# Altium schematic sheet DIB_Top_Sheet.SchDoc
size A4
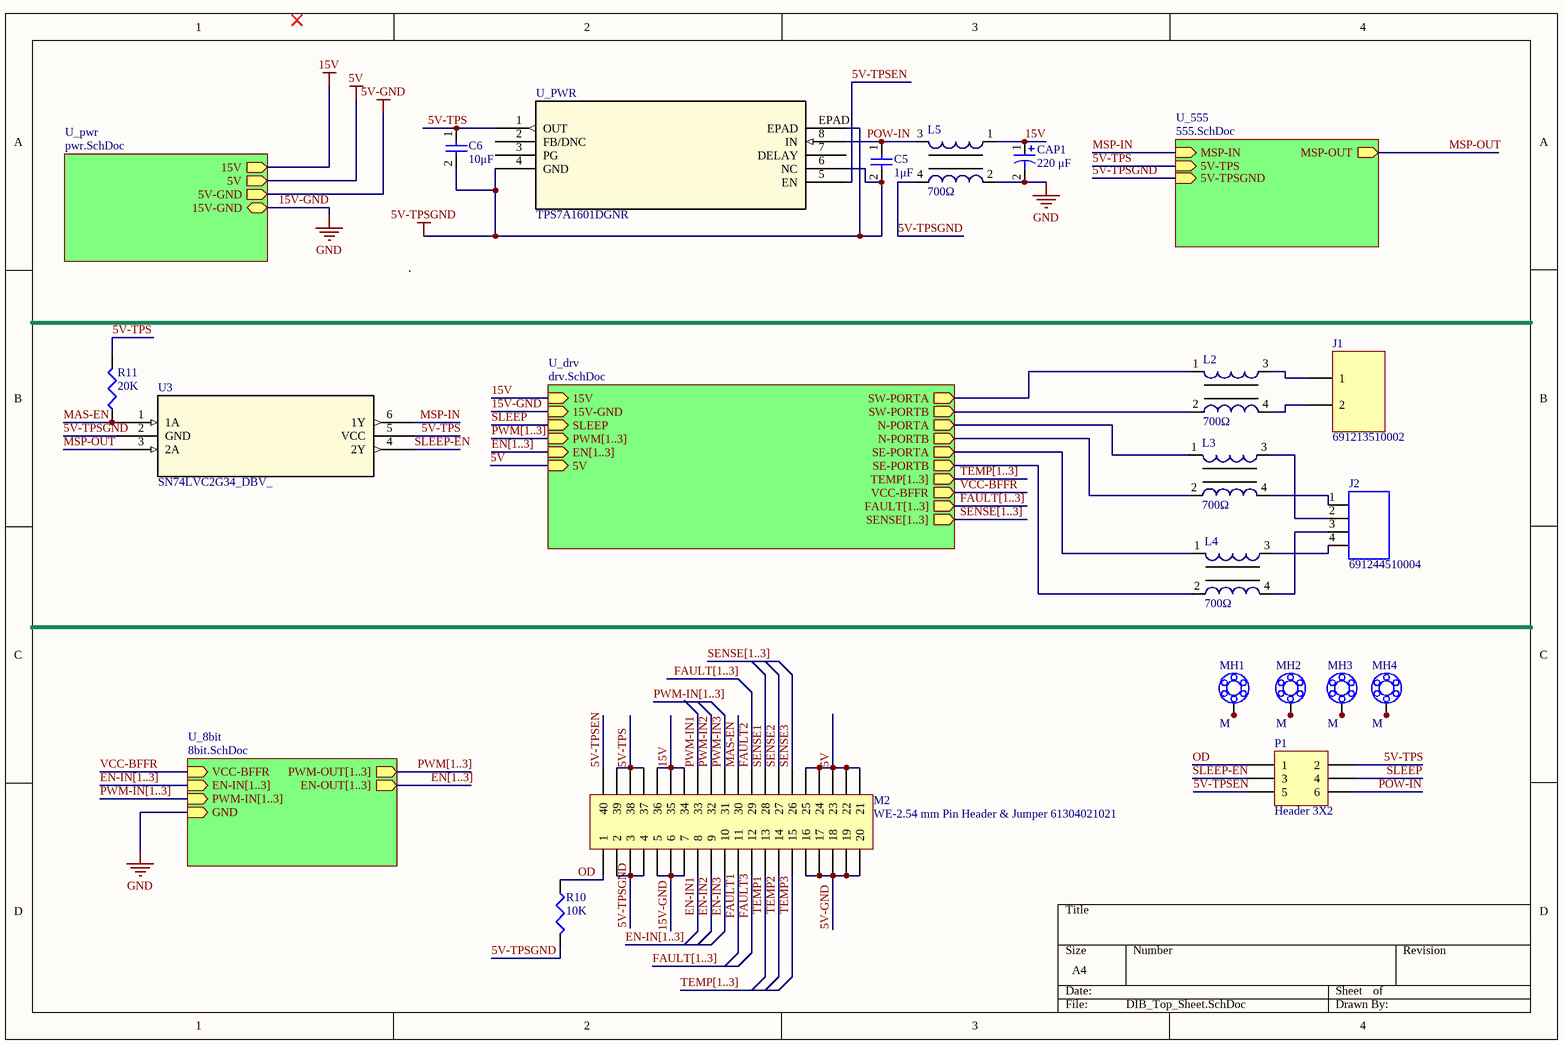
[diagram p0: DIB_Top_Sheet.SchDoc]

## Parts
C5  1μF  [WCAP-CSGP 0805, H=1.25mm]
C6  10μF  [WCAP-CSGP 0805, H=1.25mm]
CAP1  220 μF  [WCAP-ASLL 10x10.5x4.5]
J1  691213510002  [691213510002]
J2  691244510004  [691244510004]
L2  700Ω  [IND_TDK_ACM70600]
L3  700Ω  [IND_TDK_ACM70600]
L4  700Ω  [IND_TDK_ACM70600]
L5  700Ω  [IND_TDK_ACM70600]
M2  WE-2.54 mm Pin Header & Jumper 61304021021  [61304021021]
MH1  M  [MOUNTING]  (no BOM)
MH2  M  [MOUNTING]  (no BOM)
MH3  M  [MOUNTING]  (no BOM)
MH4  M  [MOUNTING]  (no BOM)
P1  Header 3X2  [HDR2X3]
R10  10K  [J1-0603]
R11  20K  [J1-0603]
U3  SN74LVC2G34_DBV_  [DBV6]
U_PWR  TPS7A1601DGNR  [DGN8_1P92X1P6]

## Sub-sheets
U_8bit = 8bit.SchDoc: EN-IN[1..3] (in), PWM-OUT[1..3] (out), EN-OUT[1..3] (out), PWM-IN[1..3] (in), GND (in), VCC-BFFR (in)
U_555 = 555.SchDoc: MSP-IN (in), MSP-OUT (out), 5V-TPS (in), 5V-TPSGND (in)
U_drv = drv.SchDoc: 15V (in), SW-PORTA (out), SW-PORTB (out), 15V-GND (in), N-PORTA (out), N-PORTB (out), SE-PORTB (out), SE-PORTA (out), TEMP[1..3] (out), VCC-BFFR (out), SLEEP (in), PWM[1..3] (in), EN[1..3] (in), FAULT[1..3] (out), SENSE[1..3] (out), 5V (in)
U_pwr = pwr.SchDoc: 15V (out), 5V (out), 5V-GND (out), 15V-GND

## Nets
5V: M2.21 M2.22 M2.23 M2.24 M2.25 ; sheet U_pwr/5V, sheet U_drv/5V
5V-GND: M2.16 M2.17 M2.18 M2.19 M2.20 ; sheet U_pwr/5V-GND
5V-TPSGND: C5.2 C6.2 L5.4 M2.2 M2.3 M2.4 R10.1 U3.2(GND) U_PWR.4(GND) U_PWR.6(NC) U_PWR.EPAD ; sheet U_555/5V-TPSGND
15V: CAP1.1 L5.1 M2.34 M2.35 M2.36 ; sheet U_pwr/15V, sheet U_drv/15V
15V-GND: CAP1.2 L5.2 M2.5 M2.6 M2.7 ; sheet U_pwr/15V-GND, sheet U_drv/15V-GND, sheet U_8bit/GND  [also labelled GND]
5V-TPS: C6.1 M2.37 M2.38 M2.39 P1.2 R11.2 U3.5(VCC) U_PWR.1(OUT) ; sheet U_555/5V-TPS
5V-TPSEN: M2.40 P1.5 U_PWR.5(EN)
EN-IN1: M2.8
EN-IN2: M2.9
EN-IN3: M2.10
FAULT1: M2.11
FAULT2: M2.29
FAULT3: M2.12
MAS-EN: M2.30 R11.1 U3.1(1A)
MSP-IN: U3.6(1Y) ; sheet U_555/MSP-IN
MSP-OUT: U3.3(2A) ; sheet U_555/MSP-OUT
OD: M2.1 P1.1 R10.2
POW-IN: C5.1 L5.3 P1.6 U_PWR.8(IN)
PWM-IN1: M2.33
PWM-IN2: M2.32
PWM-IN3: M2.31
SENSE1: M2.28
SENSE2: M2.27
SENSE3: M2.26
SLEEP: P1.4 ; sheet U_drv/SLEEP
SLEEP-EN: P1.3 U3.4(2Y)
TEMP1: M2.13
TEMP2: M2.14
TEMP3: M2.15
VCC-BFFR: sheet U_drv/VCC-BFFR, sheet U_8bit/VCC-BFFR
NetJ1_1: J1.1 L2.3
NetJ1_2: J1.2 L2.4
NetJ2_1: J2.1 L3.4
NetJ2_2: J2.2 L3.3
NetJ2_3: J2.3 L4.4
NetJ2_4: J2.4 L4.3
NetL2_1: L2.1 ; sheet U_drv/SW-PORTA
NetL2_2: L2.2 ; sheet U_drv/SW-PORTB
NetL3_1: L3.1 ; sheet U_drv/N-PORTA
NetL3_2: L3.2 ; sheet U_drv/N-PORTB
NetL4_1: L4.1 ; sheet U_drv/SE-PORTA
NetL4_2: L4.2 ; sheet U_drv/SE-PORTB
NetMH1_1: MH1.1 MH1.2 MH1.3 MH1.4 MH1.5 MH1.6 MH1.7 MH1.8 MH1.9
NetMH2_1: MH2.1 MH2.2 MH2.3 MH2.4 MH2.5 MH2.6 MH2.7 MH2.8 MH2.9
NetMH3_1: MH3.1 MH3.2 MH3.3 MH3.4 MH3.5 MH3.6 MH3.7 MH3.8 MH3.9
NetMH4_1: MH4.1 MH4.2 MH4.3 MH4.4 MH4.5 MH4.6 MH4.7 MH4.8 MH4.9

Not connected (* = marked no-connect by the designer): U_PWR 2(FB/DNC) 3(PG) 7(DELAY)

## Buses and harness runs
bus EN-IN[1..3]
bus EN-IN[1..3] = sheet U_8bit/EN-IN[1..3]
bus EN[1..3] = sheet U_8bit/EN-OUT[1..3]
bus EN[1..3] = sheet U_drv/EN[1..3]
bus FAULT[1..3]
bus FAULT[1..3] = sheet U_drv/FAULT[1..3]
bus PWM-IN[1..3]
bus PWM-IN[1..3] = sheet U_8bit/PWM-IN[1..3]
bus PWM[1..3] = sheet U_8bit/PWM-OUT[1..3]
bus PWM[1..3] = sheet U_drv/PWM[1..3]
bus SENSE[1..3]
bus SENSE[1..3] = sheet U_drv/SENSE[1..3]
bus TEMP[1..3]
bus TEMP[1..3] = sheet U_drv/TEMP[1..3]

## Library data of the parts
C5 = WCAP-CSGP 0805, 885012207026: CAP CER 1UF 50V 10% X5R 0805; Manufacturer: TDK; partNo: CGA4J3X5R1H105K125AB (C6); ComponentLink1Description: TDK; ComponentLink1URL: http://www.TDK.com; Created by: Saurabh; Created Date: 3/9/2015; Capacitance: 1μF
C6 = WCAP-CSGP 0805, 885012207026: CAP CER 10UF 6.3V 10% X7R 0805; Manufacturer: TDK; partNo: CGJ4J1X7R0J106K125AC; ComponentLink1Description: TDK; ComponentLink1URL: http://www.TDK.com; Created by: Saurabh; Created Date: 3/9/2015; Capacitance: 10μF
CAP1 = WCAP-ASLL 10x10.5x4.5 865060557008: WCAP-ASLL Aluminum Electrolytic Capacitors , 220 μF; + / - 20%; 35 V , 10 x 10,5; Manufacturer: Wurth Elektronik; E-mail: libraries@we-online.com; Characteristics: Aluminum Electrolytic Capacitor;Recommended soldering: Reflow;Operating temperature: –55 °C to +105 °C;Low impedance product series;Load life: 2000–5000 h @ +105 °C; ComponentLink1Description: Manufacturer; ComponentLink1URL: http://www.we-online.com; ComponentLink2Description: Datasheet; ComponentLink2URL: http://katalog.we-online.de/pbs/datasheet/865060557008.pdf; Created by: Karrer Zheng; Created Date: 5/13/2015; Capacitance: 220 μF; Application: Energy storage or high frequency filtering in the low voltage circuit; used as power supply filtering in general switching power supply, DC-DC converter, AC-DC converter, conversion adapter, charger, TV, VCR, DC motor circuit filter, digital audio, digital TV, digital camera, digital video camera, satellite receiver, equipment control panel and etc.; partNo: 865060557008
J1 = 691213510002: Horizontal Cable Entry with Rising Cage Clamp, Serie 2135 - 5.08 mm; Manufacturer: Wurth Elektronik; ComponentLink1 Description: Manufacturer; ComponentLink2 Description: Datasheet; NoPins: 2; ComponentLink1 URL: http://www.we-online.com; ComponentLink2 URL: http://katalog.we-online.de/em/datasheet/6912135100xx.pdf; Created By: Baojun Chen; Created Date: 6-Aug-15; PartNo: 691213510002
J2 = 691244510004: WR-TBL Horizontal Cable Entry With Rising Cage Clamp,Serie 2445 - 5.08 mm; Manufacturer: Wurth Elektronik; ComponentLink1 Description: Manufacturer; ComponentLink2 Description: Datasheet; ComponentLink1URL: http://www.we-online.de; ComponentLink2URL: http://katalog.we-online.de/em/datasheet/6912445100XX.pdf; Created by: Baojun Chen; Created Date: 15.Sep.2015; partNo: 691244510004
L2-L4 = WE-SCC 7345, 744281100: ACM7060-701-2PL-TL01; Manufacturer: TDK; partNo: ACM7060-701-2PL-TL01; Inductance: N/A; ComponentLink1Description: TDK; ComponentLink1URL: http://www.tdk.com; Created by: Saurabh Sharma; Created Date: November 2016; Impedance: 700Ω
L5 = WE-SCC 7345, 744281100: ACM7060-701-2PL-TL01; pin to pad: 3>4 4>3; Manufacturer: TDK; partNo: ACM7060-701-2PL-TL01; Inductance: N/A; ComponentLink1Description: TDK; ComponentLink1URL: http://www.tdk.com; Created by: Saurabh Sharma; Created Date: November 2016; Impedance: 700Ω
M2 = WE-2.54 mm Pin Header & Jumper 61304021021: WR-PHD 2.54 mm Angled Dual Pin Header; Manufacturer: W¨¹rth Elektronik eiSos GmbH; ComponentLink1 Description: Manufacturer; ComponentLink2 Description: Datasheet; NoPins: 40; Created Date: 25 March 2013; partNo: 61304021021; ComponentLink1URL: http://www.we-online.com; ComponentLink2URL: http://katalog.we-online.de/em/datasheet/6130xx21021.pdf; Created by: Karrer Zheng
MH1-MH4 = MOUNTING: MOUNTING HOLE - NON INSTALLABLE
P1 = Header 3X2: Header, 3-Pin, Dual row; LatestRevisionDate: 17-Jul-2002; LatestRevisionNote: Re-released for DXP Platform.; Publisher: Altium Limited
R10 R11 = Res3: Resistor; Published: 8-Jun-2000; LatestRevisionDate: 29-May-2009; LatestRevisionNote: IPC-7351 Footprint Added.; PackageReference: J1-0603; Publisher: Altium Limited; PackageDescription: Chip Resistor
  R10: Value: 10K
  R11: Value: 20K
U3 = SN74LVC2G34_DBV_: Imported; Manufacturer: Texas Instruments; Manufacturer_Part_Number: sn74lvc2g34_dbv_6; INDUSTRY_STD_PKG_TYPE: SOT-23; FAMILY_NAME: LL BUFFER GATE; PIN_COUNT: 6; PACKAGE_DESIGNATOR: DBV; Datasheet URL: http://www.ti.com/lit/gpn/SN74LVC2G34; GENERIC_PART_NUMBER: SN74LVC2G34; Vendor: Texas Instruments; RefDes: RefDes; Type: DEV; Value: Value
U_PWR = TPS7A1601DGNR: Imported; Vendor: Texas Instruments; PACKAGE_DESIGNATOR: DGN; PIN_COUNT: 8; FAMILY_NAME: SINGLE CHANNEL LDO; INDUSTRY_STD_PKG_TYPE: MSOP-PowerPAD; 3D_Library_Name: TI_AllParts_2012-12-25; C: Copyright (C) 2015 Accelerated Designs. All rights reserved; Manufacturer_Part_Number: TPS7A1601DGNR; GENERIC_PART_NUMBER: TPS7A1601; Copyright: Copyright (C) 2015 Accelerated Designs. All rights reserved; Datasheet_URL: http://www.ti.com/lit/gpn/TPS7A1601; Manufacturer: Texas Instruments; Value: Value; Type: Type; RefDes: RefDes